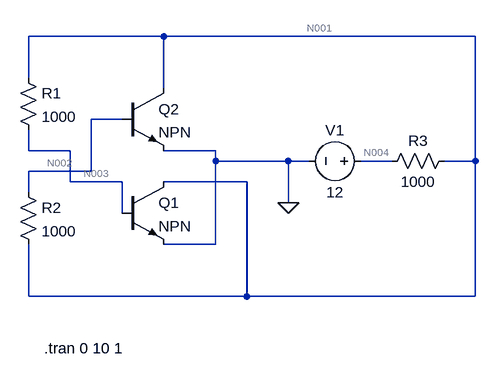
[diagram p0: schematic Humidity Sensor.asc]
Humidity Sensor.asc, the LTspice schematic file:
Version 4
SHEET 1 880 680
WIRE 208 144 0 144
WIRE 688 144 208 144
WIRE 0 208 0 144
WIRE 208 224 208 144
WIRE 144 272 96 272
WIRE 0 320 0 288
WIRE 64 320 0 320
WIRE 288 320 208 320
WIRE 288 336 288 320
WIRE 400 336 288 336
WIRE 432 336 400 336
WIRE 560 336 512 336
WIRE 688 336 688 144
WIRE 688 336 640 336
WIRE 96 352 96 272
WIRE 96 352 0 352
WIRE 64 368 64 320
WIRE 144 368 64 368
WIRE 336 368 208 368
WIRE 0 384 0 352
WIRE 400 400 400 336
WIRE 144 416 144 368
WIRE 288 464 288 336
WIRE 288 464 208 464
WIRE 0 544 0 464
WIRE 336 544 336 368
WIRE 336 544 0 544
WIRE 688 544 688 336
WIRE 688 544 336 544
FLAG 400 400 0
SYMBOL npn 144 224 R0
SYMATTR InstName Q2
SYMBOL npn 144 368 R0
SYMATTR InstName Q1
SYMBOL res -16 192 R0
SYMATTR InstName R1
SYMATTR Value 1000
SYMBOL res -16 368 R0
SYMATTR InstName R2
SYMATTR Value 1000
SYMBOL voltage 528 336 R90
WINDOW 0 -32 56 VBottom 2
WINDOW 3 32 56 VTop 2
WINDOW 123 0 0 Left 0
WINDOW 39 0 0 Left 0
SYMATTR InstName V1
SYMATTR Value 12
SYMBOL res 656 320 R90
WINDOW 0 0 56 VBottom 2
WINDOW 3 32 56 VTop 2
SYMATTR InstName R3
SYMATTR Value 1000
TEXT 24 624 Left 2 !.tran 0 10 1

The netlist it stands for:
* Humidity Sensor.asc
Q2 N001 N002 0 0 NPN
Q1 N001 N003 0 0 NPN
R1 N001 N003 1000
R2 N002 N001 1000
V1 N004 0 12
R3 N001 N004 1000
.model NPN NPN
.model PNP PNP
.lib standard.bjt
.tran 0 10 1
.backanno
.end

* Results of the author's LTspice run, read from the files saved beside the schematic
* Operating Point, zero values left out:
*   V(n001) = 873.4 mV
*   V(n002) = 818.4 mV
*   V(n003) = 818.4 mV
*   V(n004) = 12 V
*   Ic(Q1) = 5.508 mA
*   Ib(Q1) = 55.08 µA
*   Ie(Q1) = -5.563 mA
*   Ic(Q2) = 5.508 mA
*   Ib(Q2) = 55.08 µA
*   Ie(Q2) = -5.563 mA
*   I(R3) = -11.13 mA
*   I(R2) = -55.08 µA
*   I(R1) = 55.08 µA
*   I(V1) = -11.13 mA